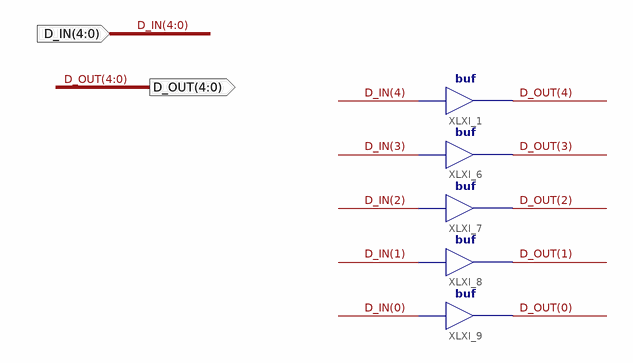
[diagram p0: schematic sheet 1]
// Xilinx ISE schematic buf_5.sch (artix7) as structural Verilog: 5 symbols, 2 ports
module buf_5 (
  input  [4:0] D_IN,
  output [4:0] D_OUT
);

  buf XLXI_1 (D_OUT[4], D_IN[4]);
  buf XLXI_6 (D_OUT[3], D_IN[3]);
  buf XLXI_7 (D_OUT[2], D_IN[2]);
  buf XLXI_8 (D_OUT[1], D_IN[1]);
  buf XLXI_9 (D_OUT[0], D_IN[0]);
endmodule
